# EAGLE design Ham-Dip (EAGLE 8.2.1)
VCC: 5v
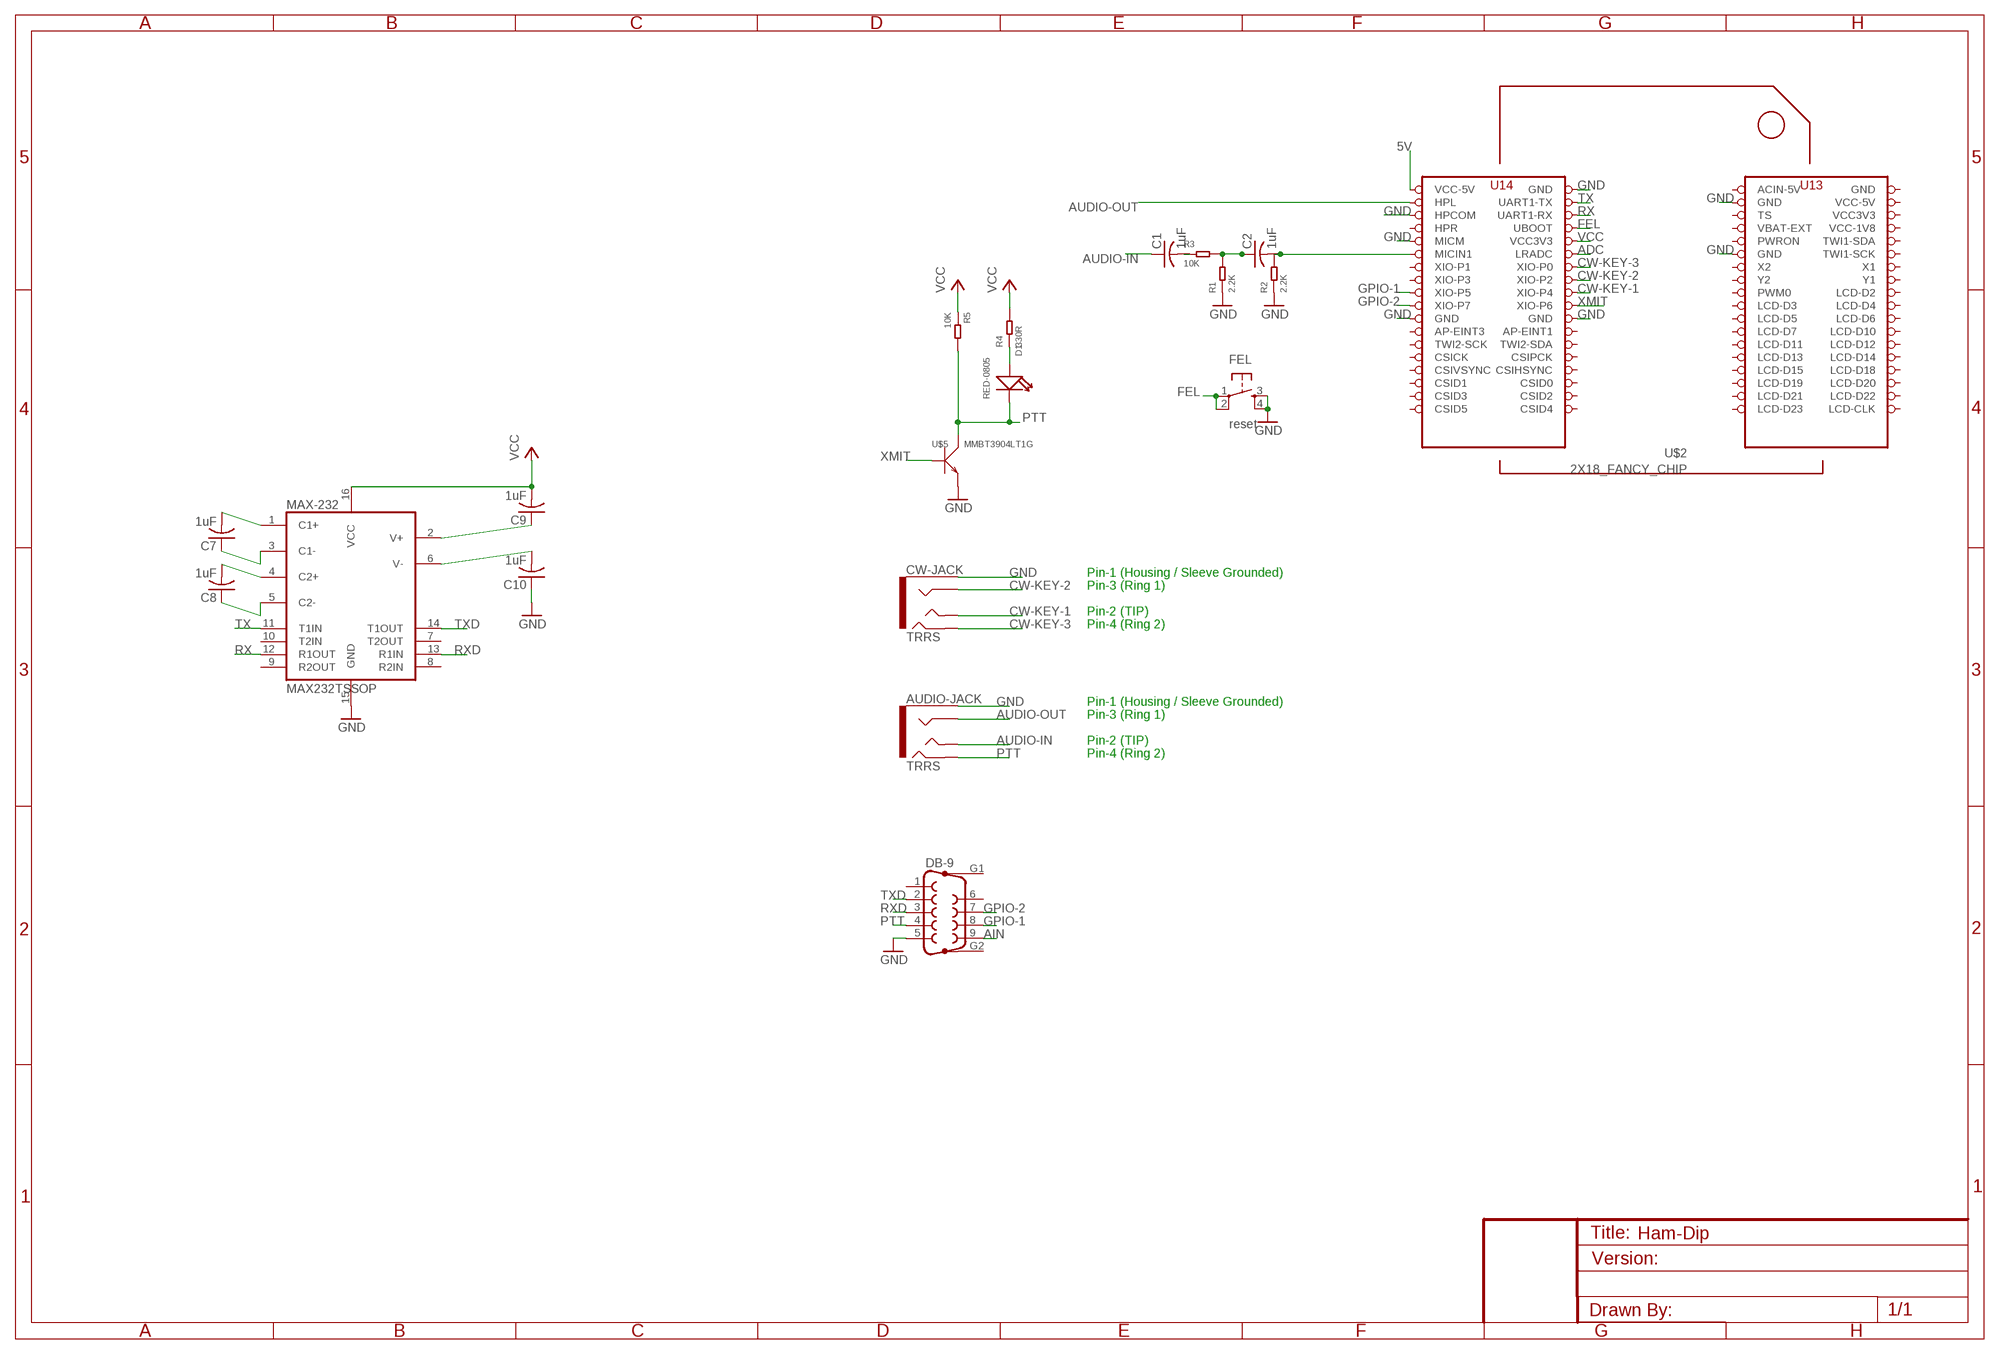
[diagram p0: schematic, sheet 1]

## Parts
AUDIO-JACK  TRRS  AUDIO-JACK3  [AUDIO-JACK-TRRS-SMD]
C1  1uF  C-USC0805  [C0805]
C2  1uF  C-USC0805  [C0805]
C7  1uF  C-USC0805  [C0805]
C8  1uF  C-USC0805  [C0805]
C9  1uF  C-USC0805  [C0805]
C10  1uF  C-USC0805  [C0805]
CW-JACK  TRRS  AUDIO-JACK3  [AUDIO-JACK-TRRS-SMD]
D1  RED-0805  SMD-LED-CLEAR-RED(0805)  [LED-0805]
DB-9  F09HP  [F09HP]
FEL  reset  TAC_SWITCHSMD  [TACTILE_SWITCH_SMD]
MAX-232  MAX232TSSOP  [TSSOP16]
R1  2.2K  SMD-RES-2.2K-5%-1/8W(0805)  [R0805]
R2  2.2K  SMD-RES-2.2K-5%-1/8W(0805)  [R0805]
R3  10K  SMD-RES-10K-1%-1/8W(0805)  [R0805]
R4  330R  SMD-RES-220R-5%-1/8W(0805)  [R0805]
R5  10K  SMD-RES-10K-1%-1/8W(0805)  [R0805]
U$2  2X18_FANCY_CHIP  [2X18_FANCY_EDGE_CHIP_TH]
U$5  MMBT3904LT1G  SMD-TRANSISTORS-NPN-40V-200MA-MMBT3904LT1G(SOT-23)  [SOT-23]

## Nets
5V: U$2.72(VCC-5V)
ADC: U$2.61(LRADC)
AIN: DB-9.9
AUDIO-IN: AUDIO-JACK.TIP C1.1
AUDIO-OUT: AUDIO-JACK.RING1 U$2.70(HPL)
CW-KEY-1: CW-JACK.TIP U$2.55(XIO-P4)
CW-KEY-2: CW-JACK.RING1 U$2.57(XIO-P2)
CW-KEY-3: CW-JACK.RING2 U$2.59(XIO-P0)
FEL: FEL.1 FEL.2 U$2.65(UBOOT)
GND: AUDIO-JACK.EARTH C10.1 CW-JACK.EARTH DB-9.5 FEL.3 FEL.4 MAX-232.15(GND) R1.1 R2.1 U$2.26(GND) U$2.34(GND) U$2.51(GND) U$2.52(GND) U$2.64(MICM) U$2.68(HPCOM) U$2.71(GND) U$5.2(E)
GPIO-1: DB-9.8 U$2.56(XIO-P5)
GPIO-2: DB-9.7 U$2.54(XIO-P7)
MIC-IN: C2.2 R2.2 U$2.62(MICIN1)
N$1: D1.+ R4.1
N$3: C1.2 R3.1
N$4: C2.1 R1.2 R3.2
N$10: C9.1 MAX-232.2(V+)
N$11: C10.2 MAX-232.6(V-)
N$16: C7.2 MAX-232.1(C1+)
N$17: C8.2 MAX-232.4(C2+)
N$18: C7.1 MAX-232.3(C1-)
N$19: C8.1 MAX-232.5(C2-)
PTT: AUDIO-JACK.RING2 D1.- DB-9.4 R5.2 U$5.3(C)
RX: MAX-232.12(R1OUT) U$2.67(UART1-RX)
RXD: DB-9.3 MAX-232.13(R1IN)
TX: MAX-232.11(T1IN) U$2.69(UART1-TX)
TXD: DB-9.2 MAX-232.14(T1OUT)
VCC: C9.2 MAX-232.16(VCC) R4.2 R5.1 U$2.63(VCC3V3)
XMIT: U$2.53(XIO-P6) U$5.1(B)
Unconnected: DB-9.1 DB-9.6 DB-9.G1 DB-9.G2 MAX-232.7(T2OUT) MAX-232.8(R2IN) MAX-232.9(R2OUT) MAX-232.10(T2IN) U$2.1(LCD-CLK) U$2.2(LCD-D23) U$2.3(LCD-D22) U$2.4(LCD-D21) U$2.5(LCD-D20) U$2.6(LCD-D19) U$2.7(LCD-D18) U$2.8(LCD-D15) U$2.9(LCD-D14) U$2.10(LCD-D13) U$2.11(LCD-D12) U$2.12(LCD-D11) U$2.13(LCD-D10) U$2.14(LCD-D7) U$2.15(LCD-D6) U$2.16(LCD-D5) U$2.17(LCD-D4) U$2.18(LCD-D3) U$2.19(LCD-D2) U$2.20(PWM0) U$2.21(Y1) U$2.22(Y2) U$2.23(X1) U$2.24(X2) U$2.25(TWI1-SCK) U$2.27(TWI1-SDA) U$2.28(PWRON) U$2.30(VBAT-EXT) U$2.32(TS) U$2.36(ACIN-5V) U$2.37(CSID4) U$2.38(CSID5) U$2.39(CSID2) U$2.40(CSID3) U$2.41(CSID0) U$2.42(CSID1) U$2.43(CSIHSYNC) U$2.44(CSIVSYNC) U$2.45(CSIPCK) U$2.46(CSICK) U$2.47(TWI2-SDA) U$2.48(TWI2-SCK) U$2.49(AP-EINT1) U$2.50(AP-EINT3) U$2.58(XIO-P3) U$2.60(XIO-P1) U$2.66(HPR)

## Notes on the sheet
- Pin-1 (Housing / Sleeve Grounded)
- Pin-3 (Ring 1)
- Pin-2 (TIP)
- Pin-4 (Ring 2)
- Pin-1 (Housing / Sleeve Grounded)
- Pin-3 (Ring 1)
- Pin-2 (TIP)
- Pin-4 (Ring 2)

## Power pins joined to a net without a drawn wire
GND: U$2.35(GND)
VCC3V3: U$2.31(VCC3V3)
VCC-1V8: U$2.29(VCC-1V8)
VCC-5V: U$2.33(VCC-5V)

## Library data of the parts
AUDIO-JACK CW-JACK = SparkFun-Connectors:AUDIO-JACK3: Audio jack - 3.5mm TRRS variety - two rings.
C1 C2 C7-C10 = adafruit:C-US: CAPACITOR, American symbol
D1 = Seeed-LED-2016:SMD-LED-CLEAR-RED(0805): 304090046; MPN: 17-215SURC/S530-A2/TR8
DB-9 = con-subd:F09HP: SUB-D; OC_FARNELL: unknown; OC_NEWARK: unknown
FEL = SparkFun-Electromechanical:TAC_SWITCH: Momentary Switch Button commonly used for reset or general input. Spark Fun Electronics SKU : COM-00097 SMT- SWCH-08247; PROD_ID: SWCH-08247
MAX-232 = SparkFun-DigitalIC:MAX232: RS232 Transceiver Very common IC. This is generically called 'MAX232', but works with the 3V equivalent MAX3232 generic ICs. Field tested and mother approved. Spark Fun Electronics SKU : COM-00316 (DIP) and COM-00589 (SMD)
R1 R2 = Seeed-Resistor-2016:SMD-RES-2.2K-5%-1/8W(0805): 301010333; MPN: RC0805JR-072K2L
R3 R5 = Seeed-Resistor-2016:SMD-RES-10K-1%-1/8W(0805): 301010361; MPN: RC0805FR-0710KL
R4 = Seeed-Resistor-2016:SMD-RES-220R-5%-1/8W(0805): 301010315; MPN: RC0805JR-07220RL; VALUE: 220R
U$2 = JKW_CHIP:2X18_FANCY_CHIP
U$5 = Seeed-Transistor-2016:SMD-TRANSISTORS-NPN-40V-200MA-MMBT3904LT1G(SOT-23): 305010013; MPN: MMBT3904LT1G

## Board
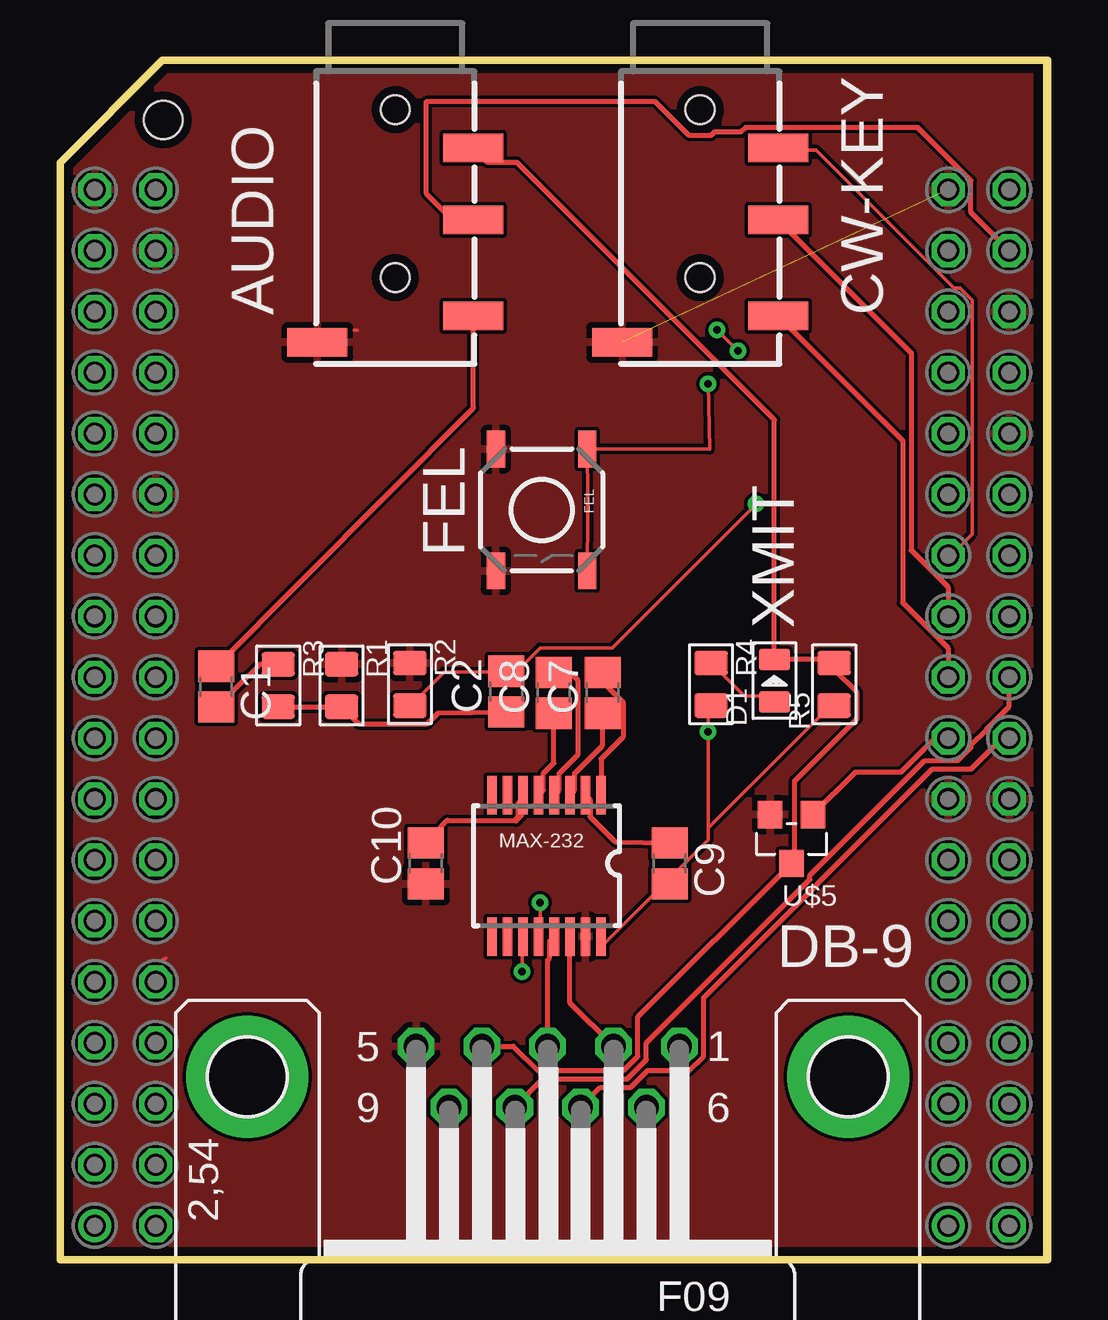
[diagram p1: board, top side]
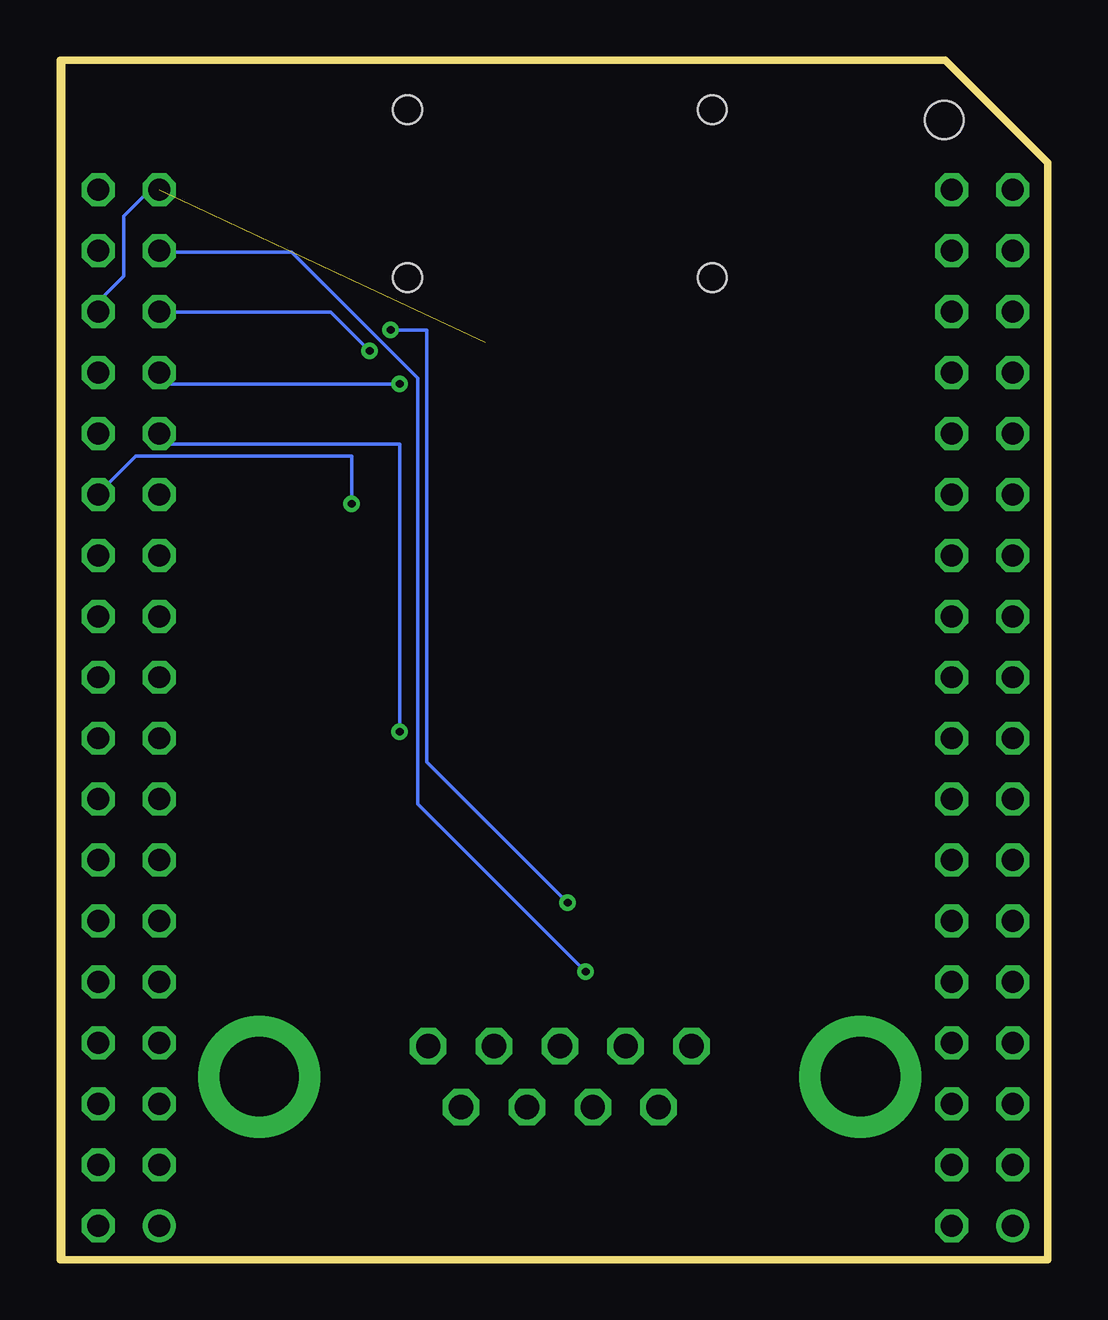
[diagram p2: board, bottom side, seen from below]

Size 41.15 x 50 mm. Coordinates in mm from the lower left corner, seen from the top.
Outline: 0,0 0,45.72 4.27,49.99 41.15,49.99 41.15,0 0,0
Copper layers (1*16): Top 0.0356mm / dielectric 1.5011mm / Bottom 0.0356mm
Design rules "LaenPCBOrder": minimum track width 6mil, minimum drill 13mil, track to track 6mil, track to pad 6mil, pad to pad 6mil, via to via 6mil, smd to smd 6mil, copper to edge 15mil, drill to drill 6mil, minimum pad ring 7mil, minimum via ring 7mil, stop-mask expansion 4mil, vias tented up to drill 0mil, thermal gap 10mil

### Footprints (pad centres in the part's own frame; a part is rotated, then mirrored left to right if it is on the bottom)
AUDIO-JACK-TRRS-SMD = smd 1.2 x 2.5: EARTH 11.3,-3.25; RING1 6.2,3.25; RING2 3.2,3.25; TIP 10.2,3.25 | hole 1.2: 1.6,0; 8.6,0
C0805 = smd 1.3 x 1.5: 1 -0.85,0; 2 0.85,0
LED-0805 = smd 0.889 x 1.27: + -0.889,0; - 0.889,0
F09HP = drill 1.016 octagon: 1 -5.486,-1.27; 2 -2.743,-1.27; 3 0,-1.27; 4 2.743,-1.27; 5 5.486,-1.27; 6 -4.115,1.27; 7 -1.372,1.27; 8 1.372,1.27; 9 4.115,1.27 | drill 3.302 pad 5.08: G1 -12.522,0; G2 12.522,0
TACTILE_SWITCH_SMD = smd 1.524 x 0.762: 1 -2.54,1.905; 2 2.54,1.905; 3 -2.54,-1.905; 4 2.54,-1.905
TSSOP16 = smd 0.4 x 1.6: 1 -2.225,-2.85; 2 -1.575,-2.85; 3 -0.925,-2.85; 4 -0.275,-2.85; 5 0.375,-2.85; 6 1.025,-2.85; 7 1.675,-2.85; 8 2.325,-2.85; 9 2.325,3.05; 10 1.675,3.05; 11 1.025,3.05; 12 0.375,3.05; 13 -0.275,3.05; 14 -0.925,3.05; 15 -1.575,3.05; 16 -2.225,3.05
R0805 = smd 1.397 x 1.016: 1 0,0.889; 2 0,-0.889
2X18_FANCY_EDGE_CHIP_TH = drill 0.914: 1 1.45,1.41; 37 37.01,1.41 | drill 0.914 octagon: 2 3.99,1.41; 3 1.45,3.95; 4 3.99,3.95; 5 1.45,6.49; 6 3.99,6.49; 7 1.45,9.03; 8 3.99,9.03; 9 1.45,11.57; 10 3.99,11.57; 11 1.45,14.11; 12 3.99,14.11; 13 1.45,16.65; 14 3.99,16.65; 15 1.45,19.19; 16 3.99,19.19; 17 1.45,21.73; 18 3.99,21.73; 19 1.45,24.27; 20 3.99,24.27; 21 1.45,26.81; 22 3.99,26.81; 23 1.45,29.35; 24 3.99,29.35; 25 1.45,31.89; 26 3.99,31.89; 27 1.45,34.43; 28 3.99,34.43; 29 1.45,36.97; 30 3.99,36.97; 31 1.45,39.51; 32 3.99,39.51; 33 1.45,42.05; 34 3.99,42.05; 35 1.45,44.59; 36 3.99,44.59; 38 39.55,1.41; 39 37.01,3.95; 40 39.55,3.95; 41 37.01,6.49; 42 39.55,6.49; 43 37.01,9.03; 44 39.55,9.03; 45 37.01,11.57; 46 39.55,11.57; 47 37.01,14.11; 48 39.55,14.11; 49 37.01,16.65; 50 39.55,16.65; 51 37.01,19.19; 52 39.55,19.19; 53 37.01,21.73; 54 39.55,21.73; 55 37.01,24.27; 56 39.55,24.27; 57 37.01,26.81; 58 39.55,26.81; 59 37.01,29.35; 60 39.55,29.35; 61 37.01,31.89; 62 39.55,31.89; 63 37.01,34.43; 64 39.55,34.43; 65 37.01,36.97; 66 39.55,36.97; 67 37.01,39.51; 68 39.55,39.51; 69 37.01,42.05; 70 39.55,42.05; 71 37.01,44.59; 72 39.55,44.59 | hole 1.6: 4.3,47.5
SOT-23 = smd 1.016 x 1.143: 1 -0.889,-1.016; 2 0.889,-1.016; 3 0,1.016

### Placement (x,y rotation side)
AUDIO-JACK  13.97,49.53 270 top
C1  6.5,23.88 270 top
C2  18.59,23.67 90 top
C7  22.61,23.62 90 top
C8  20.57,23.62 90 top
C9  25.4,16.51 270 top
C10  15.24,16.51 90 top
CW-JACK  26.67,49.53 270 top
D1  29.77,24.13 90 top
DB-9  20.32,7.62 180 top
FEL  20.07,31.24 270 top
MAX-232  20.32,16.51 180 top
R1  11.73,23.93 0 top
R2  14.58,23.98 0 top
R3  9.09,23.93 0 top
R4  27.13,23.98 0 top
R5  32.26,23.98 180 top
U$2  0,0 0 top
U$5  30.48,17.53 180 top

### Tracks (layer width: path | path; a pad name or v marks a point on that pad's centre or on a via)
AUDIO-IN
  Top 0.2: C1.1 17.22,35.49 AUDIO-JACK.TIP
AUDIO-OUT
  Top 0.2: U$2.70 37.95,43.65 37.95,44.98 35.74,47.18 28.57,47.18 28.37,46.99 27.26,46.99 27.12,46.85 26.22,46.85 24.81,48.26 15.24,48.26 15.24,44.45 16.36,43.33 AUDIO-JACK.RING1
CW-KEY-1
  Top 0.2: CW-JACK.TIP 35.11,34.14 35.11,27.38 37.01,25.48 U$2.55
CW-KEY-2
  Top 0.2: U$2.57 37.01,28.02 35.46,29.57 35.46,37.79 CW-JACK.RING1
CW-KEY-3
  Top 0.152: CW-JACK.RING2 30,46.25 31.5,46.25 37.25,40.5 37.5,40.5 38,40 38,30.25 37.25,29.5 U$2.59
FEL  (via drill 0.33)
  Top 0.152: FEL.2 21.99,31.06 21.99,31.75 FEL.1 27.07,33.78 v27,36.5
  Bottom 0.152: v27,36.5 37,36.5 U$2.65
GND  (1 unrouted)
  Top 0.152: U$2.68 39.5,39.5 39.63,39.59 | 4.25,12.5 4.4,12.56 | 12.25,38.75 12.38,38.75 | 10.57,38.38 10.5,38.5 AUDIO-JACK.EARTH
  Bottom 0.152: U$2.71 37.5,44.5 38.5,43.5 38.5,41 39.5,40 U$2.68
  pour Top: 0,50.8 43.18,50.8 41.91,-1.27 -1.27,-1.27
GPIO-1
  Top 0.2: DB-9.8 20.12,7.52 23.63,7.52 24.43,8.32 24.43,9.02 31.24,15.83 31.24,16 36.03,20.79 37.4,20.79 37.95,21.34 37.95,21.44 38.61,22.1 38.61,22.12 39.55,23.06 U$2.56
GPIO-2
  Top 0.2: DB-9.7 22.51,7.17 23.77,7.17 24.48,7.88 26.23,7.88 26.82,8.47 26.82,10.92 36.34,20.44 37.96,20.44 39.25,21.73 U$2.54
MIC-IN  (via drill 0.33)
  Top 0.152: R2.2 15,23.5 16,24.5 18.5,24.5 C2.2 19,24.5 20,25.5 23,25.5 v29,31.5
  Bottom 0.152: v29,31.5 29,33.5 38,33.5 39.5,32 U$2.62
N$1
  Top 0.152: D1.+ 29.5,23.5 28.5,23.5 27.5,24.5 R4.1
N$3
  Top 0.2: C1.2 8.34,24.82 R3.1
N$4
  Top 0.2: R3.2 R1.2 12.44,22.33 15.31,22.33 15.75,22.77 C2.1
N$10
  Top 0.2: MAX-232.2 22.09,19.16 22.09,18.45 23.14,17.41 C9.1
N$11
  Top 0.152: MAX-232.6 19.25,19.25 19.25,18.5 19,18.25 18.95,18.31
  Top 0.2: 19.1,19.05 19.1,18.45 18.95,18.31 16.14,18.31 C10.2
N$16
  Top 0.2: MAX-232.1 22.55,20.87 23.46,21.78 23.46,23.23 22.61,24.08 C7.2
N$17
  Top 0.2: MAX-232.4 20.79,19.56 20.79,20.27 21.59,21.06 21.59,24.13 21.2,24.52 C8.2
N$18
  Top 0.2: MAX-232.3 21.44,19.56 21.44,20.27 22.61,21.43 C7.1
N$19
  Top 0.2: MAX-232.5 20.14,19.56 20.14,20.27 20.57,20.7 C8.1
PTT
  Top 0.2: DB-9.4 18.89,8.89 19.9,7.88 23.48,7.88 24.08,8.47 24.08,10.11 U$5.3 30.61,16.64 30.61,19.95 33.21,22.55 33.21,23.63 32.26,24.58 R5.2 32.11,25.02 D1.- 29.77,35 19.05,45.72 17.83,45.72 AUDIO-JACK.RING2
RX  (via drill 0.33)
  Top 0.152: v20,14.88 20,13.5 MAX-232.12 | v28.25,37.88 v27.38,38.75
  Bottom 0.152: v20,14.88 25.88,20.75 25.88,38.75 v27.38,38.75 | v28.25,37.88 29.88,39.5 U$2.67
RXD
  Top 0.2: DB-9.3 20.32,12.48 20.4,12.55 20.4,13.26 MAX-232.13
TX  (via drill 0.33)
  Top 0.152: v19.25,12 19.25,13.25 MAX-232.11
  Bottom 0.152: v19.25,12 26.25,19 26.25,36.75 31.5,42 37,42 U$2.69
TXD
  Top 0.2: DB-9.2 21.25,10.71 MAX-232.14
VCC  (via drill 0.33)
  Top 0.152: MAX-232.16 22.5,13 25,15.5 C9.2 25.5,16 27,17.5 27,18 | 27,18 v27,22 27,23 R4.2 | 27,18 32,23 R5.1
  Bottom 0.152: v27,22 27,34 37,34 U$2.63
XMIT
  Top 0.2: U$5.1 33.15,20.32 35.06,20.32 36.47,21.73 U$2.53

### Text on the board
tPlace: AUDIO | CW-KEY | FEL | XMIT